# EAGLE design ESP32 UWB Pro with Display v1.2 (EAGLE 6.1)
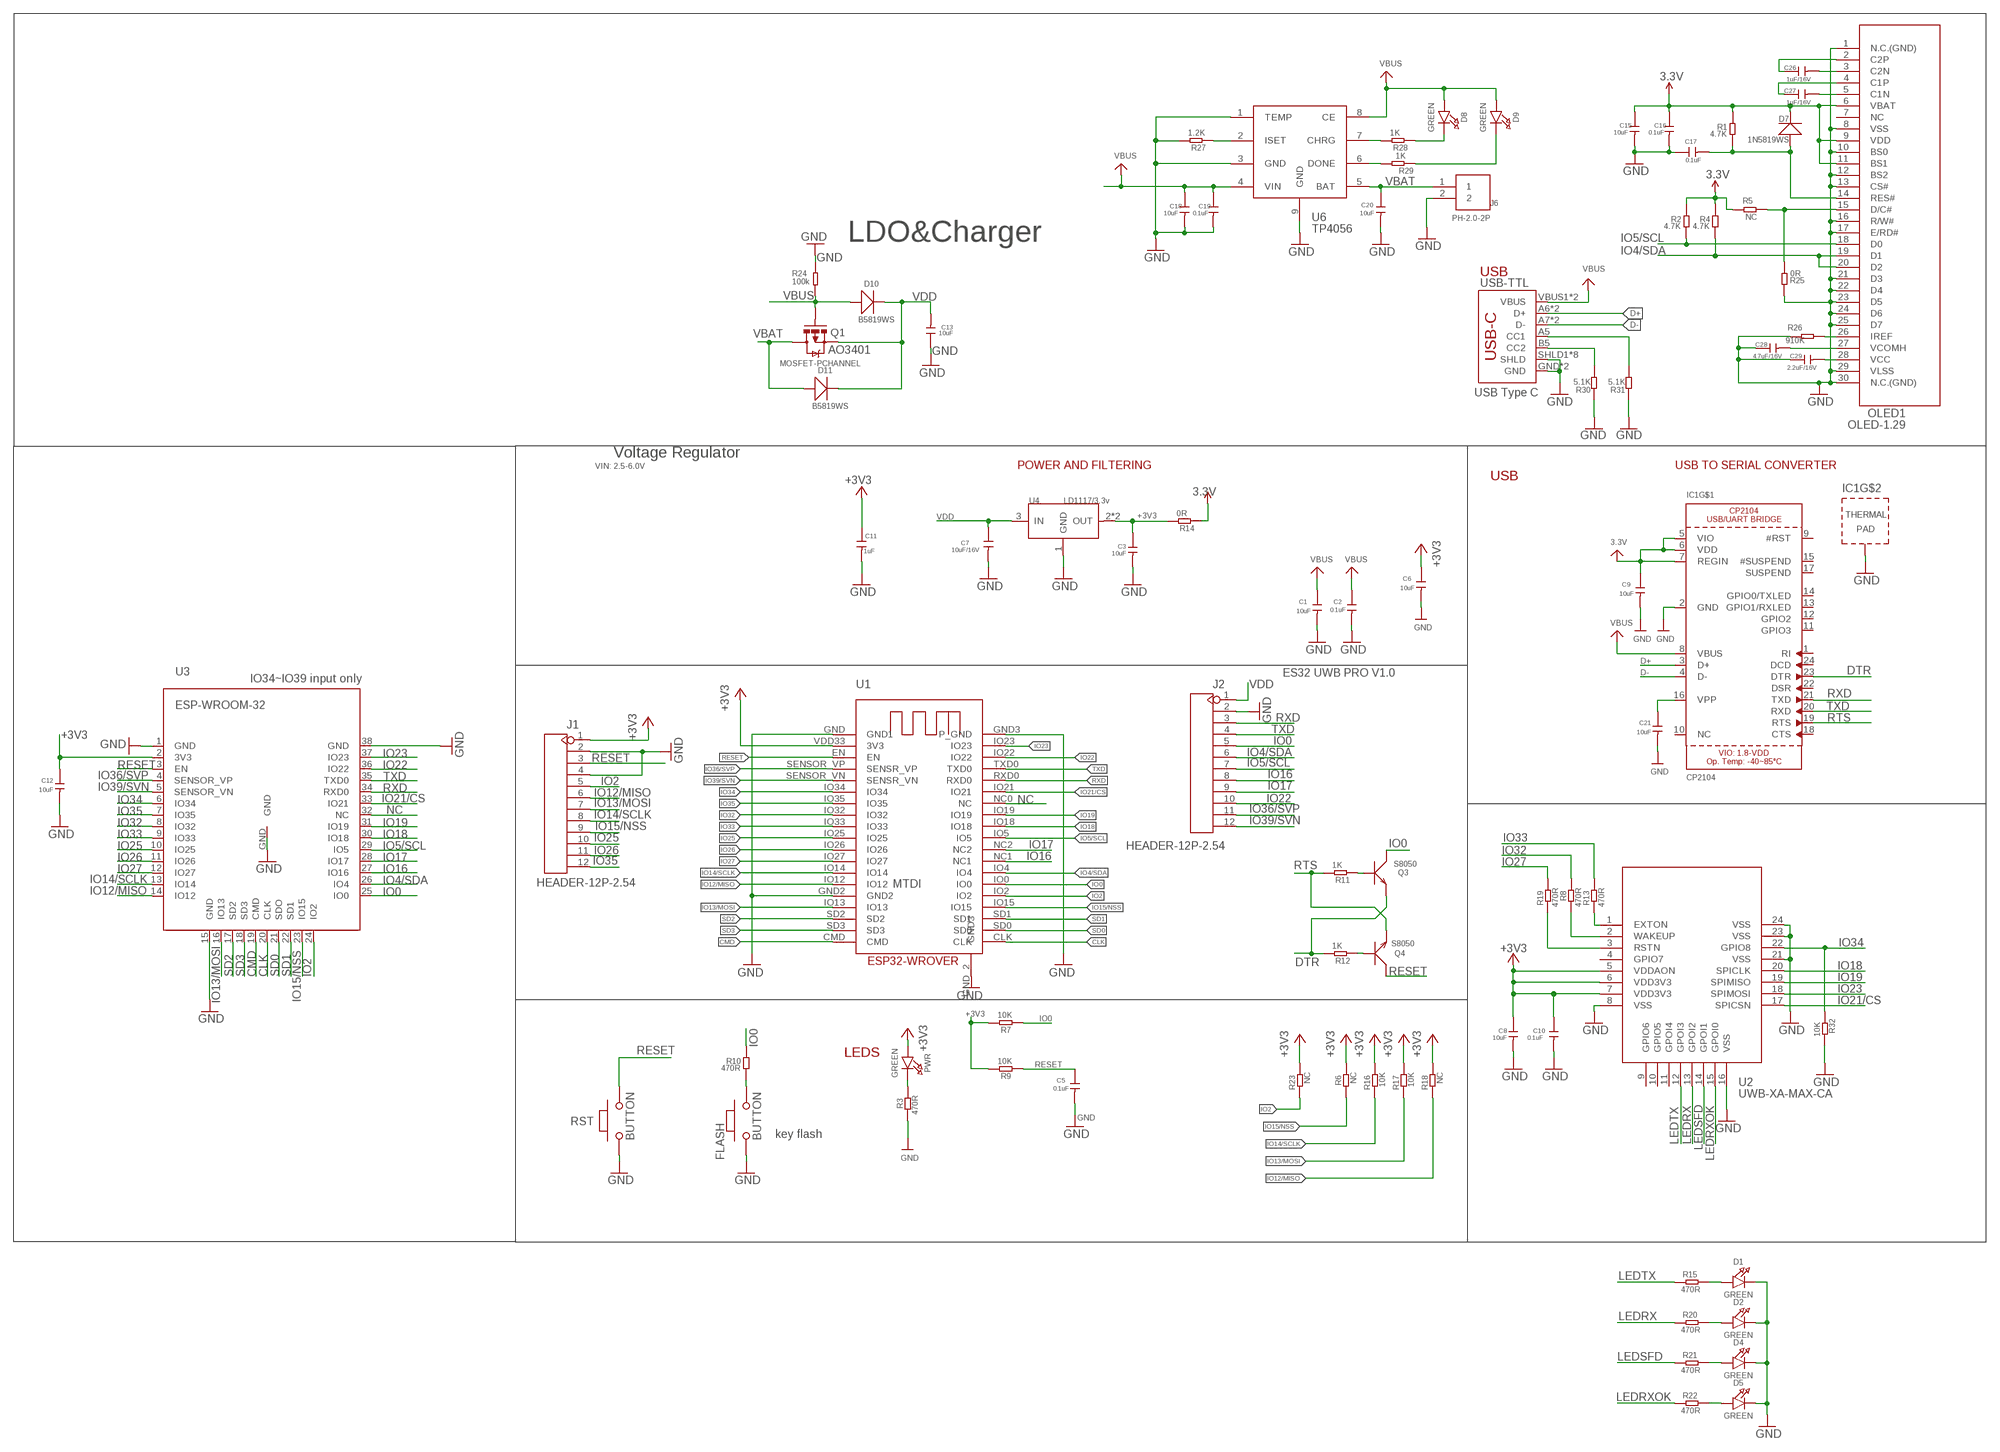
[diagram p0: schematic, sheet 1]

## Parts
C1  10uF  C-0603  [0603]
C2  0.1uF  C-0603  [0603]
C3  10uF  C-0603  [0603]
C5  0.1uF  C-0603  [0603]
C6  10uF  C-0603  [0603]
C7  10uF/16V  C-0603  [0603]
C8  10uF  C-0603  [0603]
C9  10uF  C-0603  [0603]
C10  0.1uF  C-0603  [0603]
C11  1uF  C-0603  [0603]
C12  10uF  C-0603  [0603]
C13  10uF  C-0603  [0603]
C15  10uF  C-0603  [0603]
C16  0.1uF  C-0603  [0603]
C17  0.1uF  C-0603  [0603]
C18  10uF  C-0603  [0603]
C19  0.1uF  C-0603  [0603]
C20  10uF  C-0603  [0603]
C21  10uF  C-0603  [0603]
C26  1uF/16V  C-0603  [0603]
C27  1uF/16V  C-0603  [0603]
C28  4.7uF/16V  C-0603  [0603]
C29  2.2uF/16V  C-0603  [0603]
D1  GREEN  LED0805_NOOUTLINE  [CHIPLED_0805_NOOUTLINE]
D2  GREEN  LED0805_NOOUTLINE  [CHIPLED_0805_NOOUTLINE]
D4  GREEN  LED0805_NOOUTLINE  [CHIPLED_0805_NOOUTLINE]
D5  GREEN  LED0805_NOOUTLINE  [CHIPLED_0805_NOOUTLINE]
D7  1N5819WS  D'0805'  [SOD323]
D8  GREEN  LED0805_NOOUTLINE  [CHIPLED_0805_NOOUTLINE]
D9  GREEN  LED0805_NOOUTLINE  [CHIPLED_0805_NOOUTLINE]
D10  B5819WS  D'0805'  [SOD323]
D11  B5819WS  D'0805'  [SOD323]
FLASH  BUTTON  PB157  [157SW]
IC1  CP2104  [QFN24_4MM_SMSC]
J1  HEADER-12P-2.54  [12P-2.54]
J2  HEADER-12P-2.54  [12P-2.54]
J6  PH-2.0-2P  [PH-2.0-2P]
OLED1  OLED-1.29  [OLED-1.29]
PWR  GREEN  LED0805_NOOUTLINE  [CHIPLED_0805_NOOUTLINE]
Q1  MOSFET-PCHANNEL  [SOT23-3]
Q3  S8050  TRANSISTOR-NPN-SOT23  [SOT23]
Q4  S8050  TRANSISTOR-NPN-SOT23  [SOT23]
R1  4.7K  R-0603  [R0603]
R2  4.7K  R-0603  [R0603]
R3  470R  R-0603  [R0603]
R4  4.7K  R-0603  [R0603]
R5  NC  R-0603  [R0603]
R6  NC  R-0603  [R0603]
R7  10K  R-0603  [R0603]
R8  470R  R-0603  [R0603]
R9  10K  R-0603  [R0603]
R10  470R  R-0603  [R0603]
R11  1K  R-0603  [R0603]
R12  1K  R-0603  [R0603]
R13  470R  R-0603  [R0603]
R14  0R  R-0603  [R0603]
R15  470R  R-0603  [R0603]
R16  10K  R-0603  [R0603]
R17  10K  R-0603  [R0603]
R18  NC  R-0603  [R0603]
R19  470R  R-0603  [R0603]
R20  470R  R-0603  [R0603]
R21  470R  R-0603  [R0603]
R22  470R  R-0603  [R0603]
R23  NC  R-0603  [R0603]
R24  100k  R-0603  [R0603]
R25  0R  R-0603  [R0603]
R26  910K  R-0603  [R0603]
R27  1.2K  R-0603  [R0603]
R28  1K  R-0603  [R0603]
R29  1K  R-0603  [R0603]
R30  5.1K  DISCRETE_R-0603  [DISCRETE_R0603]
R31  5.1K  DISCRETE_R-0603  [DISCRETE_R0603]
R32  10K  R-0603  [R0603]
RST  BUTTON  PB157  [157SW]
U1  ESP32-WROVER  [ESP32-WROVER]
U2  UWB-XA-MAX-CA  [UWB-X1-MAK-CA]
U3  ESP-WROOM-32  [ESP-WROOM-32]
U4  LD1117/3.3v  LD1117'SOT89'  [SOT89]
U6  TP4056  [SOP8-1.27P]
USB-TTL  USB_C5  [USB-C-16P-5]

## Nets
3.3V: C15.1 C16.1 D7.- OLED1.6(VBAT) OLED1.9(VDD) OLED1.11(BS1) R1.2 R2.2 R4.2 R5.2 R14.1
+3V3: C3.1 C6.1 C8.1 C9.1 C10.1 C11.1 C12.1 IC1.5(VIO) IC1.6(VDD) IC1.7(REGIN) J1.1 PWR.A R6.2 R7.2 R9.2 R14.2 R16.2 R17.2 R18.2 R23.2 U1.VDD33(3V3) U2.5(VDDAON) U2.6(VDD3V3) U2.7(VDD3V3) U3.2(3V3) U4.2(OUT) U4.4(OUT) ; supply symbol labelled 3.3V
CLK: U1.CLK U3.20(CLK)
CMD: U1.CMD U3.19(CMD)
D+: IC1.3(D+) USB-TTL.A6(D+) USB-TTL.B6(D+)
D-: IC1.4(D-) USB-TTL.A7(D-) USB-TTL.B7(D-)
DTR: IC1.23(DTR) Q3.2(E) R12.2
GND: C1.2 C2.2 C3.2 C5.2 C6.2 C7.2 C8.2 C9.2 C10.2 C11.2 C12.2 C13.1 C15.2 C16.2 C17.1 C18.2 C19.2 C20.2 C21.2 C28.1 C29.1 D1.C D2.C D4.C D5.C FLASH.1 IC1.2(GND) IC1.THERM(TP) J1.2 J1.4 J2.2 J6.2 OLED1.1(N.C.(GND)) OLED1.8(VSS) OLED1.10(BS0) OLED1.12(BS2) OLED1.13(CS#) OLED1.16(R/W#) OLED1.17(E/RD#) OLED1.21(D3) OLED1.22(D4) OLED1.23(D5) OLED1.24(D6) OLED1.25(D7) OLED1.29(VLSS) OLED1.30(N.C.(GND)) R3.1 R24.2 R25.2 R26.2 R27.2 R30.1 R31.1 R32.2 RST.1 U1.GND2 U1.GND3(P_GND) U1.GND(GND1) U1.GND_2(GND3) U2.8(VSS) U2.16(VSS) U2.21(VSS) U2.23(VSS) U2.24(VSS) U3.1(GND) U3.15(GND) U3.38(GND) U3.GND U4.1(GND) U6.1(TEMP) U6.3(GND) U6.9(GND) USB-TTL.GND USB-TTL.GND2(GND) USB-TTL.SHLD1(SHLD) USB-TTL.SHLD2(SHLD) USB-TTL.SHLD3(SHLD) USB-TTL.SHLD4(SHLD) USB-TTL.SHLD5(SHLD) USB-TTL.SHLD6(SHLD) USB-TTL.SHLD7(SHLD) USB-TTL.SHLD8(SHLD)
IO0: J2.5 Q3.3(C) R7.1 R10.2 U1.IO0 U3.25(IO0)
IO2: J1.5 R23.1 U1.IO2 U3.24(IO2)
IO4/SDA: J2.6 OLED1.19(D1) OLED1.20(D2) R4.1 U1.IO4 U3.26(IO4)
IO5/SCL: J2.7 OLED1.18(D0) R2.1 U1.IO5 U3.29(IO5)
IO12/MISO: J1.6 R18.1 U1.IO12 U3.14(IO12)
IO13/MOSI: J1.7 R17.1 U1.IO13 U3.16(IO13)
IO14/SCLK: J1.8 R16.1 U1.IO14 U3.13(IO14)
IO15/NSS: J1.9 R6.1 U1.IO15 U3.23(IO15)
IO16: J2.8 U1.NC1 U3.27(IO16)
IO17: J2.9 U1.NC2 U3.28(IO17)
IO18: U1.IO18 U2.20(SPICLK) U3.30(IO18)
IO19: U1.IO19 U2.19(SPIMISO) U3.31(IO19)
IO21/CS: U1.IO21 U2.17(SPICSN) U3.33(IO21)
IO22: J2.10 U1.IO22 U3.36(IO22)
IO23: U1.IO23 U2.18(SPIMOSI) U3.37(IO23)
IO25: J1.10 U1.IO25 U3.10(IO25)
IO26: J1.11 U1.IO26 U3.11(IO26)
IO27: R19.2 U1.IO27 U3.12(IO27)
IO32: R8.2 U1.IO32 U3.8(IO32)
IO33: R13.2 U1.IO33 U3.9(IO33)
IO34: R32.1 U1.IO34 U2.22(GPIO8) U3.6(IO34)
IO35: J1.12 U1.IO35 U3.7(IO35)
IO36/SVP: J2.11 U1.SENSOR_VP(SENSR_VP) U3.4(SENSOR_VP)
IO39/SVN: J2.12 U1.SENSOR_VN(SENSR_VN) U3.5(SENSOR_VN)
LEDRX: R20.1 U2.13(GPOI2)
LEDRXOK: R22.1 U2.15(GPOI0)
LEDSFD: R21.1 U2.14(GPOI1)
LEDTX: R15.1 U2.12(GPOI3)
N$1: D1.A R15.2
N$2: C21.1 IC1.16(VPP)
N$3: C17.2 D7.+ OLED1.14(RES#) R1.1
N$4: OLED1.15(D/C#) R5.1 R25.1
N$5: PWR.C R3.2
N$6: C28.2 OLED1.27(VCOMH)
N$7: C26.2 OLED1.3(C2N)
N$8: C29.2 OLED1.28(VCC)
N$9: OLED1.26(IREF) R26.1
N$10: R13.1 U2.1(EXTON)
N$11: R8.1 U2.2(WAKEUP)
N$12: R19.1 U2.3(RSTN)
N$13: Q4.1(B) R12.1
N$14: Q3.1(B) R11.1
N$15: FLASH.2 R10.1
N$16: D2.A R20.2
N$17: D4.A R21.2
N$18: D5.A R22.2
N$19: C26.1 OLED1.2(C2P)
N$21: C27.1 OLED1.4(C1P)
N$22: C27.2 OLED1.5(C1N)
N$23: R27.1 U6.2(ISET)
N$25: R31.2 USB-TTL.A5(CC1)
N$26: R30.2 USB-TTL.B5(CC2)
N$29: R28.2 U6.7(CHRG)
N$30: R29.2 U6.6(DONE)
N$31: D8.C R28.1
N$32: D9.C R29.1
NC: U1.NC0(NC) U3.32(NC)
RESET: C5.1 J1.3 Q4.3(C) R9.1 RST.2 U1.EN U3.3(EN)
RTS: IC1.19(RTS) Q4.2(E) R11.2
RXD: IC1.21(TXD) J2.3 U1.RXD0 U3.34(RXD0)
SD0: U1.SD0 U3.21(SDO)
SD1: U1.SD1 U3.22(SD1)
SD2: U1.SD2 U3.17(SD2)
SD3: U1.SD3 U3.18(SD3)
TXD: IC1.20(RXD) J2.4 U1.TXD0 U3.35(TXD0)
VBAT: C20.1 D11.+ J6.1 Q1.3(D) U6.5(BAT)
VBUS: C1.1 C2.1 C18.1 C19.1 D8.A D9.A D10.+ IC1.8(VBUS) Q1.1(G) R24.1 U6.4(VIN) U6.8(CE) USB-TTL.VBUS1(VBUS) USB-TTL.VBUS2(VBUS)
VDD: C7.1 C13.2 D10.- D11.- J2.1 Q1.2(S) U4.3(IN)
Unconnected: IC1.1(RI) IC1.9(#RST) IC1.10(NC) IC1.11(GPIO3) IC1.12(GPIO2) IC1.13(GPIO1/RXLED) IC1.14(GPIO0/TXLED) IC1.15(#SUSPEND) IC1.17(SUSPEND) IC1.18(CTS) IC1.22(DSR) IC1.24(DCD) OLED1.7(NC) U2.4(GPIO7) U2.9(GPIO6) U2.10(GPIO5) U2.11(GPOI4)

## Notes on the sheet
- LDO&Charger
- USB
- AO3401
- USB Type C
- Voltage Regulator
- VIN: 2.5-6.0V | POWER AND FILTERING | USB TO SERIAL CONVERTER
- USB
- ES32 UWB PRO V1.0
- IO34~IO39 input only
- MTDI
- LEDS
- key flash

## Library data of the parts
C1-C3 C5-C13 C15-C21 C26-C29 = Discrete:C*: Ceramic Capacitors
D1 D2 D4 D5 D8 D9 PWR = microbuilder:LED: LED 0603 - 0603 Surface Mount Package 2mA: Green LED - Low Power (3.9mcd, 2ma, 1.7Vf) - Digikey: 475-2709-2-ND Orange LED - Low Power (9.8mcd, 2ma, 1.8Vf) - Digikey: 475-1194-2-ND Red LED - Low Power (5mcd, 2ma, 1.8Vf) - Digikey: 475-1195-2-ND Yellow LED - Low Power (7mcd, 2ma, 1.8Vf) - Digikey: 475-1196-2-ND 5mA: Blue LED - Low Power (17mcd, 5ma, 2.9Vf) - Digikey: LNJ937W8CRACT-ND 0805 - 0805 Surface Mount Package 2mA: Red LED (8.8mcd, 2mA, 1.8Vf, Clear) - Low Power [Digikey: 475-2510-1-ND] Green LED (5mcd, 2mA, 1.8Vf, Clear) - Low Power [Digikey: 475-2730-1-ND] Yellow LED (11.3mcd, 2mA, 1.8Vf, Clear) - Low Power [Digikey: 475-2555-1-ND] 20mA: Red LED (104mcd, 20mA, Diffused) - LS R976 [Digikey: 475-1278-6-ND] Red LED (12mcd, 20mA, 2.0Vf, Clear) - APT2012EC [Digikey: 754-1128-1-ND] Green LED (15mcd, 20mA, 2.2Vf, Clear) - APT2012GC [Digikey: 754-1131-1-ND] Orange LED (160mcd, 20mA, 2.1Vf, Clear) - APT2012SECK [Digikey: 754-1130-1-ND] 1206 - 1206 Surface Mount Package Green LED (26mcd, 20mA, Diffused) - LG N971 [Digikey: 475-1407-6-ND] Red LED (15mcd, 20mA, Diffused) - LH N974 [Digikey: 475-1416-6-ND] Cree - Cree High-Power Surface Mount LEDs XPEBWT-L1-0000-00D50 - White 111lm 350mA 2.9Vf 6200K 110° XTEAWT-00-0000-00000LEE3 - White 114lm 350mA 2.85Vf 5000K 115° Everlight - Everlight 45-21 Series Surface Mount LEDs 45-21/QK2C-B2832AC2CB2/2T - Warm White 2000mcd 20mA 3.25Vf 3050K 120° 45-21/LK2C-B38452C4CB2/2T - Nuetral White 2000mcd 20mA 3.25Vf 4150K 120° 45-21/LK2C-B50634C6CB2/2T - Cold White 2200mcd 20mA 3.25Vf 5650K 120° PLCC2 Reverse Mount LS T77K-J1L2-1-0-2-R18-Z - Red 11.25mcd 2mA 1.8Vf 630nm 120° LO T77K-L1M2-24-Z - Orange 19.6mcd 2mA 1.8Vf 606nm 120° LY T77K-K2M1-26-Z - Yellow 15.7mcd 2mA 1.8Vf 587nm 120°
D7 D10 D11 = Discrete:D*
FLASH RST = MySMD:PB157
IC1 = microbuilder:CP2104: CP2104 - USB to UART Bridge VDD Output: 3.45V
J1 J2 = Connector:HEADER-12P
J6 = Connector:PH-2.0-2P
OLED1 = sale:OLED-1.29
Q1 = User-Submitted:MOSFET-PCHANNEL: Generic PMOSFET IRLML2244 - TRANS-11153 (SOT-23 -20V -4.3A) (1.Gate 2.Source 3.Drain) FQP27P06 - COM-10349 <http://www.sparkfun.com/products/10349> (TO-220 -60V -27A) (1.Gate 2.Source 3.Drain); PROD_ID: TRANS-08285
Q3 Q4 = Discrete:TRANSISTOR-NPN*: NPN audion
R1-R29 R32 = Discrete:R*
R30 R31 = A9G:DISCRETE_R*
U1 = ESP32-Wrover:ESP32-WROVER
U2 = sale:UWB-XA-MAX-CA
U3 = esp32:ESP-WROOM-32
U4 = IC:LD1117: Low Drop Fixed And Adjustable Positive Voltage Regulators http://www.datasheetcatalog.org/datasheet/SGSThomsonMicroelectronics/mXuqtqv.pdf
U6 = self:TP4056
USB-TTL = USBC:USB_C: USB Type C 16Pin Connector Super Speed pins not available on the 16-pin purely SMD connector so this part is best for USB 2.0 implementations. D1 and D2 are tied together enabling D+/- no matter which way the cable is plugged into the connector. The two channel configuration pins (CC1/2) are exposed. These are normally connected to ground via 5.1k resistors but can be reconfigured for high current/high power applications.

## Net classes
0 default: width 0.203 mm, drill 0.305 mm, clearance 0.152 mm

## Board
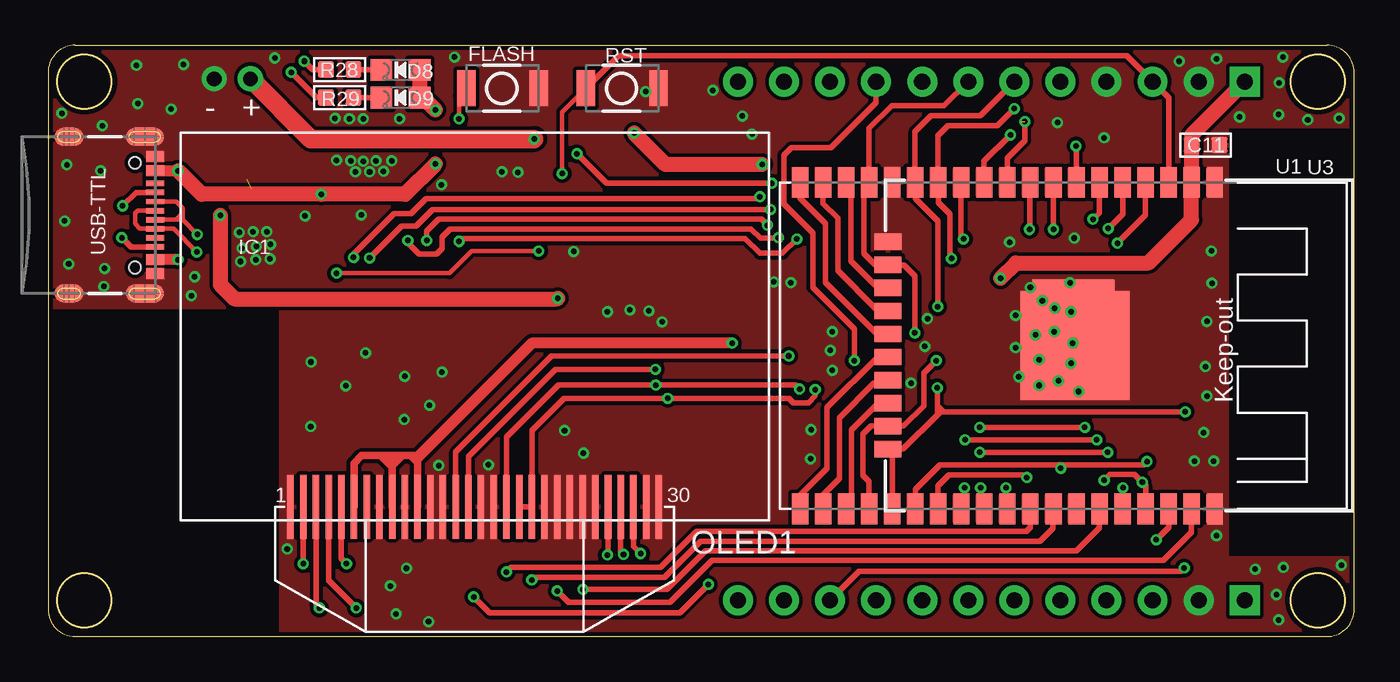
[diagram p1: board, top side]
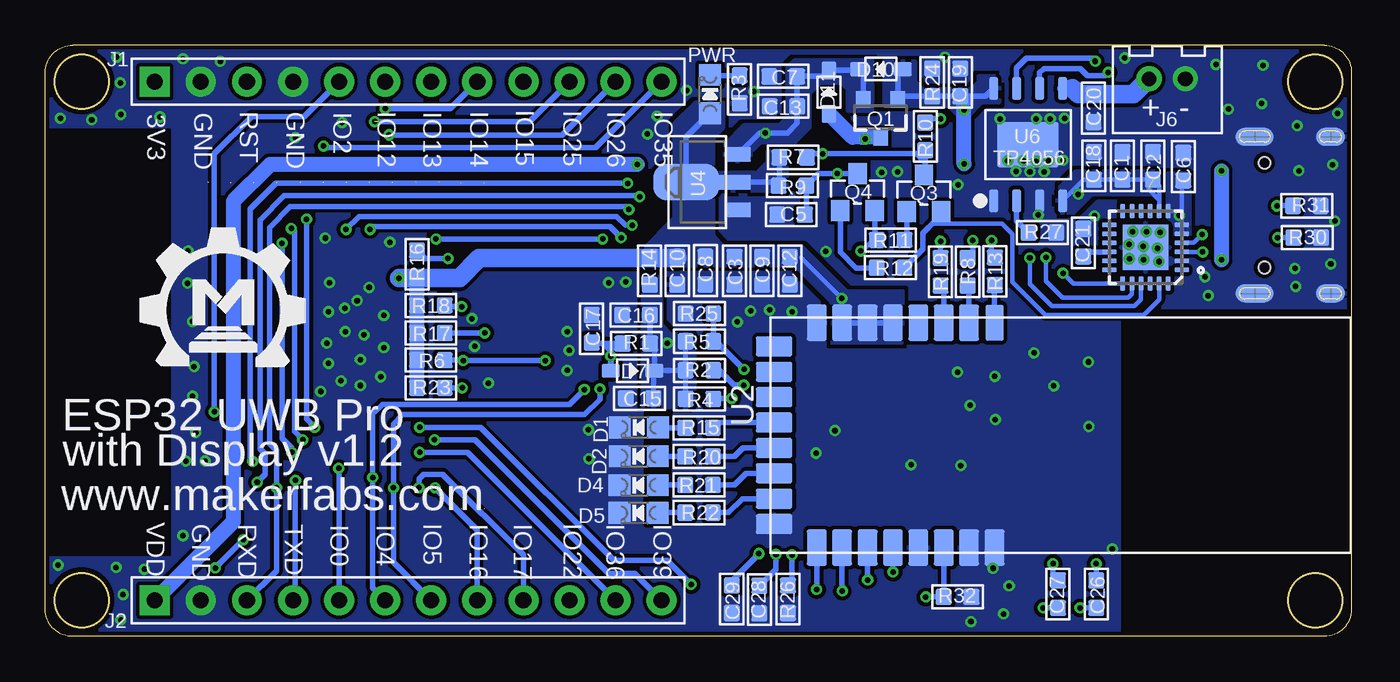
[diagram p2: board, bottom side, seen from below]

Size 72 x 32.6 mm. Coordinates in mm from the lower left corner, seen from the top.
Outline: 70.5,0 arc90 72,1.5 72,31.1 arc90 70.5,32.6 1.5,32.6 arc90 0,31.1 0,1.5 arc90 1.5,0 arc0 1.5,0 70.5,0
Outline: circle at 2,2 radius 1.5
Outline: circle at 2,30.6 radius 1.5
Outline: circle at 70,30.6 radius 1.5
Outline: circle at 70,2 radius 1.5
Copper layers (1*16): Top 0.035mm / dielectric 1.5mm / Bottom 0.035mm
Design rules: minimum track width 10mil, minimum drill 10mil, track to track 8mil, track to pad 8mil, pad to pad 8mil, via to via 8mil, smd to smd 0mil, copper to edge 10mil, drill to drill 8mil, minimum pad ring 10mil, minimum via ring 6mil, stop-mask expansion 4mil, vias tented up to drill 100mil, thermal gap 0mil
tRestrict: area 65.1,4.4 to 72,28; area 0,-0.1 to 12.7,18
bRestrict: area 65.1,4.4 to 71.9,28; area 0,0 to 12.7,18

### Footprints (pad centres in the part's own frame; a part is rotated, then mirrored left to right if it is on the bottom)
0603 = smd 0.889 x 0.889: 1 -0.762,0; 2 0.762,0
CHIPLED_0805_NOOUTLINE = smd 1.2 x 1.2: A 0,-1.05; C 0,1.05
SOD323 = smd 1 x 0.8: + -1.2,0; - 1.2,0
157SW = smd 1.016 x 1.981: 1 0,0; 2 4,0
QFN24_4MM_SMSC = smd 0.8 x 0.28: 1 -2,1.25; 2 -2,0.75; 3 -2,0.25; 4 -2,-0.25; 5 -2,-0.75; 6 -2,-1.25; 13 2,-1.25; 14 2,-0.75; 15 2,-0.25; 16 2,0.25; 17 2,0.75; 18 2,1.25 | smd 0.28 x 0.8: 7 -1.25,-2; 8 -0.75,-2; 9 -0.25,-2; 10 0.25,-2; 11 0.75,-2; 12 1.25,-2; 19 1.25,2; 20 0.75,2; 21 0.25,2; 22 -0.25,2; 23 -0.75,2; 24 -1.25,2 | smd 2.5 x 2.5: THERM 0,0
12P-2.54 = drill 0.889 pad 1.651 square: 1 0,13.97 | drill 0.889 pad 1.651: 2 0,11.43; 3 0,8.89; 4 0,6.35; 5 0,3.81; 6 0,1.27; 7 0,-1.27; 8 0,-3.81; 9 0,-6.35; 10 0,-8.89; 11 0,-11.43; 12 0,-13.97
PH-2.0-2P = drill 0.8 pad 1.4: 1 -1,0; 2 1,0
OLED-1.29 = smd 0.4 x 3.5: 1 -10.15,-9.94; 2 -9.45,-9.94; 3 -8.75,-9.94; 4 -8.05,-9.94; 5 -7.35,-9.94; 6 -6.65,-9.94; 7 -5.95,-9.94; 8 -5.25,-9.94; 9 -4.55,-9.94; 10 -3.85,-9.94; 11 -3.15,-9.94; 12 -2.45,-9.94; 13 -1.75,-9.94; 14 -1.05,-9.94; 15 -0.35,-9.94; 16 0.35,-9.94; 17 1.05,-9.94; 18 1.75,-9.94; 19 2.45,-9.94; 20 3.15,-9.94; 21 3.85,-9.94; 22 4.55,-9.94; 23 5.25,-9.94; 24 5.95,-9.94; 25 6.65,-9.94; 26 7.35,-9.94; 27 8.05,-9.94; 28 8.75,-9.94; 29 9.45,-9.94; 30 10.15,-9.94
SOT23-3 = smd 0.8 x 0.9: 1 -0.95,-1; 2 0.95,-1; 3 0,1.1
SOT23 = smd 1.016 x 1.143: 1 -0.95,-1.016; 2 0.95,-1.016; 3 0,1.016
R0603 = smd 0.889 x 0.889: 1 -0.762,0; 2 0.762,0
DISCRETE_R0603 = smd 0.889 x 0.889: 1 -0.762,0; 2 0.762,0
ESP32-WROVER = smd 1.7 x 0.9: CLK 18,1.27; CMD 0,1.27; EN 0,21.59; GND 0,24.13; GND3 18,24.13; GND_2 0,6.35; IO0 18,7.62; IO2 18,6.35; IO4 18,8.89; IO5 18,12.7; IO12 0,7.62; IO13 0,5.08; IO14 0,8.89; IO15 18,5.08; IO18 18,13.97; IO19 18,15.24; IO21 18,17.78; IO22 18,21.59; IO23 18,22.86; IO25 0,12.7; IO26 0,11.43; IO27 0,10.16; IO32 0,15.24; IO33 0,13.97; IO34 0,17.78; IO35 0,16.51; NC0 18,16.51; NC1 18,10.16; NC2 18,11.43; RXD0 18,19.05; SD0 18,2.54; SD1 18,3.81; SD2 0,3.81; SD3 0,2.54; SENSOR_VN 0,19.05; SENSOR_VP 0,20.32; TXD0 18,20.32; VDD33 0,22.86 | smd 4.5 x 4.5: GND2 7.62,16.34
UWB-X1-MAK-CA = smd 2 x 1: 1 -6.2,-3.65 | smd 2 x 1.1: 2 -6.2,-5.05; 3 -6.2,-6.45; 4 -6.2,-7.85; 5 -6.2,-9.25; 6 -6.2,-10.65; 7 -6.2,-12.05; 8 -6.2,-13.45; 17 6.2,-13.45; 18 6.2,-12.05; 19 6.2,-10.65; 20 6.2,-9.25; 21 6.2,-7.85; 22 6.2,-6.45; 23 6.2,-5.05; 24 6.2,-3.65 | smd 1.1 x 2: 9 -4.9,-15.8; 10 -3.5,-15.8; 11 -2.1,-15.8; 12 -0.7,-15.8; 13 0.7,-15.8; 14 2.1,-15.8; 15 3.5,-15.8; 16 4.9,-15.8
ESP-WROOM-32 = smd 0.9 x 1.5: 1 7.7,9; 2 6.43,9; 3 5.16,9; 4 3.89,9; 5 2.62,9; 6 1.35,9; 7 0.08,9; 8 -1.19,9; 9 -2.46,9; 10 -3.73,9; 11 -5,9; 12 -6.27,9; 13 -7.54,9; 14 -8.81,9; 25 -8.81,-9; 26 -7.54,-9; 27 -6.27,-9; 28 -5,-9; 29 -3.73,-9; 30 -2.46,-9; 31 -1.19,-9; 32 0.08,-9; 33 1.35,-9; 34 2.62,-9; 35 3.89,-9; 36 5.16,-9; 37 6.43,-9; 38 7.7,-9 | smd 1.5 x 0.9: 15 -10.3,5.715; 16 -10.3,4.445; 17 -10.3,3.175; 18 -10.3,1.905; 19 -10.3,0.635; 20 -10.3,-0.635; 21 -10.3,-1.905; 22 -10.3,-3.175; 23 -10.3,-4.445; 24 -10.3,-5.715 | smd 6 x 6: GND 0,0
SOT89 = smd 0.8 x 1.4: 1 -1.524,-1.905; 3 1.524,-1.905 | smd 0.8 x 1.9: 2 0,-1.651 | smd 2.032 x 3.65: 4 0,0.94
SOP8-1.27P = smd 1.27 x 0.51: 1 -3.1,1.905; 2 -3.1,0.635; 3 -3.1,-0.635; 4 -3.1,-1.905; 5 3.1,-1.905; 6 3.1,-0.635; 7 3.1,0.635; 8 3.1,1.905 | smd 2.5 x 3.4: 9 0,0
USB-C-16P-5 = smd 0.3 x 1: A5 -1.25,-0.34; A6 -0.25,-0.34; A7 0.25,-0.34; A8 1.25,-0.34; B5 1.75,-0.34; B6 0.75,-0.34; B7 -0.75,-0.34; B8 -1.75,-0.34 | smd 0.6 x 1: GND -3.225,-0.34; GND2 3.225,-0.34; VBUS1 -2.45,-0.34; VBUS2 2.45,-0.34 | smd 1 x 2.1: SHLD1 -4.32,-0.915; SHLD2 4.32,-0.915 | smd 1 x 2.1 bottom: SHLD3 -4.32,-0.915; SHLD4 4.32,-0.915 | smd 1 x 1.6: SHLD5 -4.32,-5.095; SHLD8 4.32,-5.095 | smd 1 x 1.6 bottom: SHLD6 -4.32,-5.095; SHLD7 4.32,-5.095 | hole 0.65: -2.89,-1.445; 2.89,-1.445

### Placement (x,y rotation side)
C1  12.62,25.96 90 bottom
C2  10.95,25.96 90 bottom
C3  34.01,20.17 270 bottom
C5  30.89,23.27 180 bottom
C6  9.27,25.91 90 bottom
C7  31.33,30.89 180 bottom
C8  35.62,20.18 270 bottom
C9  32.49,20.17 270 bottom
C10  37.17,20.17 270 bottom
C11  63.8,27.1 0 top
C12  30.96,20.17 270 bottom
C13  31.32,29.24 0 bottom
C15  39.24,13.13 180 bottom
C16  39.45,17.73 180 bottom
C17  41.88,16.97 270 bottom
C18  14.2,25.96 90 bottom
C19  21.56,30.56 90 bottom
C20  14.22,29.13 270 bottom
C21  14.78,21.72 90 bottom
C26  14.07,2.34 270 bottom
C27  16.18,2.34 90 bottom
C28  32.64,2.03 90 bottom
C29  34.16,2.06 90 bottom
D1  39.28,11.54 90 bottom
D2  39.29,9.94 90 bottom
D4  39.3,8.34 90 bottom
D5  39.3,6.81 90 bottom
D7  39.62,14.66 0 bottom
D8  19.43,31.24 90 top
D9  19.43,29.72 90 top
D10  25.93,31.29 180 bottom
D11  28.8,30.02 90 bottom
FLASH  27.05,30.23 180 top
IC1  11.36,21.46 180 bottom
J1  52,30.6 90 bottom
J2  52,2 90 bottom
J6  10.16,30.76 0 bottom
OLED1  23.52,17.09 0 top
PWR  35.36,29.91 0 bottom
Q1  25.96,28.63 180 bottom
Q3  23.57,24.45 0 bottom
Q4  27.23,24.51 0 bottom
R1  39.42,16.15 0 bottom
R2  35.94,14.68 180 bottom
R3  33.73,30.18 90 bottom
R4  35.94,13.11 180 bottom
R5  35.94,16.28 180 bottom
R6  50.75,15.24 180 bottom
R7  30.78,26.42 180 bottom
R8  21.16,20.12 90 bottom
R9  30.82,24.86 180 bottom
R10  23.5,27.58 270 bottom
R11  25.41,21.87 180 bottom
R12  25.41,20.34 0 bottom
R13  19.66,20.14 90 bottom
R14  38.68,20.17 90 bottom
R15  35.97,11.51 180 bottom
R16  51.51,20.52 270 bottom
R17  50.75,16.74 180 bottom
R18  50.75,18.26 180 bottom
R19  22.66,20.12 90 bottom
R20  35.97,9.93 180 bottom
R21  35.97,8.36 180 bottom
R22  35.97,6.83 180 bottom
R23  50.75,13.72 180 bottom
R24  23.11,30.56 90 bottom
R25  35.94,17.81 180 bottom
R26  31.06,2.06 270 bottom
R27  17.04,22.28 0 bottom
R28  16.08,31.27 180 top
R29  16.08,29.72 180 top
R30  2.44,22 180 bottom
R31  2.46,23.75 180 bottom
R32  21.72,2.18 0 bottom
RST  33.66,30.23 180 top
U1  40.19,25.04 270 top
U2  16.03,11.1 270 bottom
U3  56.6,16.05 0 top
U4  35.74,25.05 90 bottom
U6  17.83,27.13 90 bottom
U$1  [MAKERFABS_0.3]  66.31,14.92 0 bottom
USB-TTL  6.25,23.23 270 top

### Tracks (layer width: path | path; a pad name or v marks a point on that pad's centre or on a via)
3.3V  (via drill 0.3)
  Top 0.305: OLED1.11
  Top 0.406: OLED1.6 16.87,9.56 17.3,9.98 18.34,9.98 | 18.34,9.98 19.07,9.98 | 19.07,9.98 19.56,9.98 | 19.99,9.98 20.47,9.98 | OLED1.11 20.37,9.88 20.65,10.16 | OLED1.9 18.97,9.88 19.07,9.98 | 18.34,9.98 18.95,9.37 19.56,9.98 | 19.56,9.98 19.99,9.98 | 19.99,9.98 20.37,9.6
  Top 0.61: v37.72,16.18 26.67,16.18 20.65,10.16 20.47,9.98 20.34,9.86 20.32,9.86
  Bottom 0.305: R4.2 R2.2 | R2.2 R5.2 | C15.1 38.48,14.6 D7.- | D7.- 38.42,15.92 R1.2 38.66,17.17 | 38.66,17.17 38.66,17.7 C16.1 | R2.2 38.4,14.68 D7.- | 38.63,17.2 38.66,17.17
  pour Bottom: 36.27,12.67 39.04,12.67 39.04,19.81 38.1,19.81 38.1,17.2 37.54,16.64 36.27,16.64
+3V3  (via drill 0.3)  (1 unrouted)
  Top 0.813: v9.5,23.22 9.5,19.41 10.29,18.62 28.07,18.62 v28.09,18.64 | v52.5,19.76 53.34,20.6 60.66,20.6 63.03,22.98 U3.2 | U1.VDD33 C11.1 63.04,27.67 J1.1
  Bottom 0.254: IC1.5 IC1.6 9.36,23.32 | 9.36,23.32 9.36,25.06 C6.1 | IC1.7 9.5,23.46 9.36,23.32 | 25.93,17.35 25.88,17.3 | U2.7 28.08,18.63 v28.09,18.64 30.35,20.9
  Bottom 0.305: U2.5 25.88,17.3 U2.6 U2.7 | R7.2 31.54,24.9 R9.2 31.77,25.05 U4.2 U4.4 36.68,27.55 PWR.A
  Bottom 0.813: R23.2 R6.2 R17.2 R18.2 R16.2
  Bottom 1.016: v52.5,19.76 R16.2 49.17,19.76 48.08,20.86 37.17,20.86 C10.1
  pour Bottom: 8.94,22.07 8.94,25.53 10.08,25.53 10.13,25.53 10.13,23.16 9.7,22.73 9.7,22.1 9.7,22.07
  pour Bottom: 24.77,16.21 24.77,19 24.74,19.02 27.84,19.02 30.33,21.51 34.65,21.51 35.2,22.07 35.2,24.13 34.75,24.59 31.14,24.59 31.14,26.75 32.16,26.75 32.16,26.16 32.77,25.55 34.77,25.55 35.2,25.98 35.2,27.51 34.65,28.07 34.65,29.44 36.14,29.44 37.31,28.27 37.31,23.06 39.17,21.21 39.17,20.47 30.68,20.47 28.65,18.44 28.65,16.51 28.65,16.21
CLK
  Top 0.305: U1.CLK 41.46,7.78 42.95,9.27 42.95,12.62 45.72,15.39 46.28,15.39 U3.20
CMD
  Top 0.305: U1.CMD 41.46,24.18 42.85,22.78 42.85,19.53 45.7,16.69 U3.19
D+  (via drill 0.3)
  Top 0.254: USB-TTL.A6 4.94,23.48 4.8,23.34 4.8,22.76 5.05,22.5 5.89,22.5 USB-TTL.B6 6.93,22.48 v8.2,21.21
  Bottom 0.254: v8.2,21.21 v8.21,21.21 IC1.3
D-  (via drill 0.3)
  Top 0.254: USB-TTL.A7 7.27,22.98 7.26,22.99 7.42,22.99 | USB-TTL.B7 7.05,23.98 7.42,23.62 7.42,23.34 | 7.42,22.99 v8.23,22.17 | 7.42,23.34 7.42,22.99 | 7.42,23.34 7.06,22.99
  Bottom 0.254: IC1.4 8.69,21.71 v8.23,22.17
DTR
  Bottom 0.254: IC1.23 10.61,18.58 11.46,17.73 16.87,17.73 18.69,19.56 18.69,22.2 19.28,22.78 23.09,22.78 23.32,22.56
  Bottom 0.305: Q3.2 22.62,23.25 23.32,22.56 23.62,22.25 23.62,21.37 R12.2
GND  (via drill 0.3)
  other vias: 21.03,12.75 3.12,20.29 21.72,14.58 10.54,22.28 11.3,22.33 12.06,22.33 12.27,21.62 12.24,20.83 11.48,21.51 11.46,20.78 10.69,21.41 2.9,25.68 4.88,31.5 4.95,29.39 3,28.17 7.47,31.55 12.5,31.9 0.76,28.85 1.04,26.01 0.91,22.91 1.14,20.55 3.07,19.3 7.9,18.8 14.17,23.19 16.69,26.24 17.37,26.21 18.08,26.24 18.95,26.24 17.73,25.63 18.49,25.65 16.94,25.63 15.9,26.26 15.82,28.58 16.61,28.55 17.37,28.55 19.38,28.55 22.4,31.95 10.62,20.68 8.08,19.84 6.78,29.08 16.41,13.82 19.66,14.35 19.63,11.96 14.48,11.58 14.5,15.14 17.5,15.65 28.47,11.35 29.51,10.11 18.87,2.79 13.18,4.83 19.18,1.24 20.98,0.81 19.76,3.76 24.28,9.47 21.54,9.42 43.23,14.68 40.94,19.51 43.23,16.81 48.34,16 47.57,13.97 54.81,18.52 54.43,16.64 54.64,15.27 55.7,14.1 55.5,18.11 56.34,19.51 56.39,17.91 56.49,16.18 55.47,16.81 56.39,15.06 56.82,13.51 53.52,14.33 53.34,15.93 53.34,17.7 54.15,19.25 54.64,13.84 64.14,21.26 64.16,19.48 63.88,17.37 63.8,14.88 63.88,13.26 63.7,11.25 63.2,9.68 64.26,9.68 64.41,5.56 66.55,3.71 68.1,3.81 71.3,3.94 67.84,0.91 67.72,2.31 42.06,11.4 42.04,9.8 48.49,17.53 53.01,21.74 56.57,21.97 55.65,28.35 58.22,27.51 68.07,31.95 67.87,30.53 67.84,28.78 71.17,28.58 69.44,28.5 65.68,28.65 62.36,31.72 64.41,31.85 32.94,30.05 38.81,27.71 38.28,28.7 36.65,30.12 21.69,24.92 17.27,23.24 28.98,21.23 30.84,17.91 33.12,17.96 33.86,17.35 32.08,18.01 43.13,15.77 25.02,25.63 25.91,25.6 40.01,19.56
  pour Top (rank 6): -8.51,37.36 75.44,37.36 75.44,-3.17 -8.52,-3.17 -8.52,37.36
  pour Bottom (rank 6): -2.29,36.12 76.2,35.56 76.2,-2.54 -2.29,-1.98
IO0  (via drill 0.3)  (1 unrouted)
  Top 0.305: U3.25 47.8,7.06 47.8,8.1 49.17,9.47 55.83,9.47 | 55.83,9.47 60.4,9.47 v60.58,9.65 | v39.9,24.99 30.79,24.99 v29.16,26.62 | v55.83,9.27 55.83,9.47
  Bottom 0.305: R7.1 29.82,26.62 v29.16,26.62 23.99,26.62 23.53,26.16 23.5,26.16 | Q3.3 23.5,25.53 23.5,26.16 | 23.5,26.16 R10.2 | v39.9,24.99 59.28,24.99 60.71,23.57 60.71,9.78 v60.58,9.65 | J2.5 55.81,9.25 v55.83,9.27
IO2  (via drill 0.3)
  Top 0.305: U1.IO2 46.54,10.1 U3.24 47.14,10.33 49.02,12.22 | 49.02,12.22 49.02,12.73 | 49.02,12.73 v49.02,13.72 | v62.69,12.4 49.35,12.4 | 49.35,12.4 49.2,12.4 49.02,12.22 | 49.35,12.4 49.02,12.73
  Bottom 0.305: v62.69,12.4 62.69,26.62 60.63,28.68 57.73,28.68 J1.5 | v49.02,13.72 R23.1
IO4/SDA  (via drill 0.3)  (1 unrouted)
  Top 0.305: OLED1.19 OLED1.20 26.67,11.35 28.45,13.13 v34.16,13.13 40.84,13.13 41.1,12.88 41.91,12.88 42.29,13.26 v42.29,13.61 | U3.26 49.05,7.06 49.05,8.31 49.66,8.92 53.8,8.92 v53.95,8.76
  Bottom 0.305: v34.16,13.13 35.15,13.13 R4.1 | J2.6 53.95,2.68 v53.95,8.76 53.95,12.27 53.42,12.8 43.1,12.8 v42.29,13.61
IO5/SCL  (via drill 0.3)  (1 unrouted)
  Top 0.305: U1.IO5 52.81,7.12 v52.81,8.2 | OLED1.18 25.27,11 28.14,13.87 v33.5,13.87 41.2,13.87 v41.43,13.64
  Bottom 0.305: J2.7 52.81,4.08 v52.81,8.2 52.81,11.74 52.3,12.24 42.27,12.24 41.43,13.08 v41.43,13.64 | R2.1 34.85,14.68 34.04,13.87 v33.5,13.87
IO12/MISO  (via drill 0.3)  (1 unrouted)
  Top 0.305: U1.IO12 47.81,24.15 49.05,22.91 v49.05,18.19 | U3.14 47.79,27.85 48.67,28.73 51.4,28.73 J1.6
  Bottom 0.305: R18.1 49.91,18.19 v49.05,18.19
IO13/MOSI  (via drill 0.3)
  Top 0.305: 46.28,20.47 47.19,20.47 47.78,19.89 v47.78,16.74 | 46.28,20.47 45.62,20.47 44.98,21.11 44.98,24.76 U1.IO13 45.27,28.02 46.51,29.26 49.39,29.26 J1.7 | 46.28,20.47 U3.16
  Bottom 0.305: R17.1 v47.78,16.74
IO14/SCLK  (via drill 0.3)  (1 unrouted)
  Top 0.305: U3.13 49.05,25.06 49.05,27.61 49.61,28.17 52.32,28.17 v53.26,29.11 | U1.IO14 49.08,23.92 49.71,23.29 49.71,20.96 v49.81,20.85
  Bottom 0.305: J1.8 49.68,29.11 v53.26,29.11 | R16.1 51.08,20.85 v49.81,20.85
IO15/NSS  (via drill 0.3)
  Top 0.305: U1.IO15 45.27,8.56 44.93,8.89 44.93,11.18 45.36,11.61 U3.23 47.16,11.6 48.28,12.73 48.28,14.53 v48.97,15.22 | v44.45,15.22 44.45,16.97 42.16,19.25 42.16,22.25 40.56,23.85 40.56,26.54 40.97,26.95 43.16,26.95 45.64,29.44 J1.9
  Bottom 0.305: R6.1 49,15.24 v48.97,15.22 v44.45,15.22
IO16  (via drill 0.3)  (1 unrouted)
  Top 0.305: U1.NC1 50.52,7.22 v50.52,8.2
  Bottom 0.305: J2.8 48.19,5.87 v50.52,8.2
IO17  (via drill 0.3)  (1 unrouted)
  Top 0.305: U1.NC2 51.41,7.25 v51.41,8.2
  Bottom 0.305: v51.41,8.2 51.41,8.69 51.16,8.94 50.09,8.94 45.65,4.5 J2.9
IO18  (via drill 0.3)
  Top 0.305: U1.IO18 | U1.IO18 U3.30 | U1.IO18 54.15,6.02 53.92,5.79 35.74,5.79 33.76,3.81 25.53,3.81 v25.27,3.56
  Bottom 0.305: U2.20 v25.28,3.56 v25.27,3.56
IO19  (via drill 0.3)  (1 unrouted)
  Top 0.305: U1.IO19 U3.31 55.4,7.03 55.4,5.97 54.69,5.26 35.97,5.26 33.98,3.28 26.82,3.28 v26.67,3.12
  Bottom 0.305: U2.19 26.68,3.13 v26.67,3.12
IO21/CS  (via drill 0.3)  (1 unrouted)
  Top 0.305: 57.94,7.03 U3.33 U1.IO21 57.96,5.99 56.69,4.72 36.25,4.72 34.11,2.59 v29.49,2.59
  Bottom 0.305: U2.17 29.48,2.6 v29.49,2.59
IO22  (via drill 0.3)  (1 unrouted)
  Top 0.305: J2.10 44.69,3.58 62.43,3.58 v62.64,3.79 | v61.09,5.33 61.78,6.02 U1.IO22
  Bottom 0.305: v62.64,3.79 v61.09,5.33
IO23  (via drill 0.3)  (1 unrouted)
  Top 0.305: U1.IO23 U3.37 63.02,7.03 63.02,5.74 61.47,4.19 36.6,4.19 34.29,1.88 28.7,1.88 v28.07,2.52
  Bottom 0.305: U2.18 28.08,2.53 v28.07,2.52
IO25  (via drill 0.3)  (2 unrouted)
  Top 0.305: U3.10 52.87,26.38 53.85,27.36 v53.85,28.4
  Bottom 0.305: J1.10 45.31,28.4 53.67,28.4
IO26  (via drill 0.3)  (1 unrouted)
  Top 0.305: v53.06,27.66 51.6,26.2 U3.11
  Bottom 0.305: J1.11 43.51,27.66 v53.06,27.66
IO27  (via drill 0.3)  (1 unrouted)
  Top 0.305: 50.32,25.03 U3.12 50.33,22.06 v50.47,21.92 | v22.66,21.79 22.81,21.95 38.43,21.95 39.24,21.13 40.49,21.13 v41.27,21.92
  Bottom 0.305: R19.2 v22.66,21.79 | v41.27,21.92 v50.47,21.92
IO32  (via drill 0.3)  (1 unrouted)
  Top 0.305: U1.IO32 U3.8 55.41,22.46 v55.42,22.45 | v20.88,21.84 20.88,22.35 21.54,23.01 39.32,23.01 v39.65,22.68
  Bottom 0.305: v55.42,22.45 54.71,23.17 40.51,23.17 40.03,22.68 v39.65,22.68 | R8.2 20.88,21.16 v20.88,21.84
IO33  (via drill 0.3)  (1 unrouted)
  Top 0.305: U3.9 54.13,25.03 54.13,22.48 v54.1,22.45 | v40.26,22 40.23,21.97 39.27,21.97 38.76,22.48 22.17,22.48 21.72,22.02 21.72,21.39 21.41,21.08 20.45,21.08 19.84,21.69 v19.84,21.84
  Bottom 0.305: v40.26,22 40.87,22.61 53.95,22.61 v54.1,22.45 | R13.2 19.84,21.08 v19.84,21.84
IO34  (via drill 0.3)  (1 unrouted)
  Top 0.305: v23.47,2.18 24.33,1.32 34.85,1.32 v36.4,2.87 | U3.6 57.95,23.36 v57.61,23.01 | v51.36,11.53 v57.15,11.53
  Bottom 0.305: U2.22 R32.1 | R32.1 | v36.4,2.87 37.72,4.19 40.66,4.19 48.01,11.53 v51.36,11.53 | R32.1 v23.47,2.19 v23.47,2.18 | v57.61,23.01 57.61,11.99 v57.15,11.53
IO35  (via drill 0.3)  (1 unrouted)
  Top 0.305: U3.7 56.68,27.04 v56.67,27.05
  Bottom 0.305: J1.12 41.68,26.95 56.57,26.95 v56.67,27.05
IO36/SVP  (via drill 0.3)  (1 unrouted)
  Top 0.305: U1.SENSOR_VP 60.5,23.24 v58.95,21.69 | v51.36,10.16 v58.42,10.16
  Bottom 0.305: J2.11 48.73,10.16 v51.36,10.16 | v58.95,21.69 58.95,11.18 58.95,11.07 58.95,10.92 58.42,10.39 v58.42,10.16
IO39/SVN  (via drill 0.3)  (1 unrouted)
  Top 0.305: U1.SENSOR_VN 59.24,23.3 v58.45,22.5 | v50.55,10.85 v57.81,10.85
  Bottom 0.305: J2.12 39.51,3.48 40.95,3.48 48.31,10.85 v50.55,10.85 | v58.45,22.5 58.27,22.33 58.27,11.3 v57.81,10.85
LEDRX
  Bottom 0.305: U2.13 33.54,10.4 34.01,9.93 R20.1
LEDRXOK
  Bottom 0.305: U2.15 33.57,7.6 34.34,6.83 R22.1
LEDSFD
  Bottom 0.305: U2.14 33.37,9 34.01,8.36 R21.1
LEDTX
  Bottom 0.305: U2.12 34.91,11.8 R15.1
N$1
  Bottom 0.305: R15.2 38.2,11.51 D1.A
N$2
  Bottom 0.305: IC1.16 14.53,21.21 C21.1
N$3  (via drill 0.3)
  Top 0.305: OLED1.14 22.47,10.18 27.76,15.47 v40.84,15.47
  Bottom 0.305: 40.44,16.21 40.82,15.82 40.82,15.75 | v40.84,15.47 40.84,14.68 D7.+ 40.82,16.14 40.84,16.15 | R1.1 40.84,16.15 | 40.84,16.15 41.22,16.15 | 41.22,16.15 41.83,16.15 C17.2 | 40.82,15.6 40.82,15.75 | 40.82,15.75 41.22,16.15
N$4  (via drill 0.3)
  Top 0.305: OLED1.15 23.17,9.94 27.96,14.73 v33.48,14.73
  Bottom 0.305: R25.1 R5.1 35.03,16.28 v33.48,14.73
N$5
  Bottom 0.305: R3.2 35.34,30.94 PWR.C
N$6  (via drill 0.3)
  Top 0.305: OLED1.27 31.57,4.68 v31.73,4.52
  Bottom 0.305: v31.73,4.52 31.73,3.71 C28.2
N$7  (via drill 0.3)
  Top 0.305: OLED1.3 14.77,1.77 v14.96,1.58
  Bottom 0.305: v14.96,1.58 C26.2
N$8  (via drill 0.3)
  Top 0.305: OLED1.28 32.27,4.97 v32.66,4.57
  Bottom 0.305: C29.2 34.16,3.07 v32.66,4.57
N$9  (via drill 0.3)
  Top 0.305: OLED1.26 30.87,4.53 v30.84,4.5
  Bottom 0.305: 31.09,2.85 R26.1 30.84,3.05 v30.84,4.5
N$10
  Bottom 0.305: U2.1 19.68,19.36 R13.1
N$11
  Bottom 0.305: U2.2 21.08,19.27 R8.1
N$12
  Bottom 0.305: U2.3 22.48,19.18 R19.1
N$13
  Bottom 0.305: Q4.1 28.18,21.2 27.3,20.32 26.19,20.32 R12.1
N$14
  Bottom 0.305: Q3.1 24.52,21.99 R11.1
N$15  (via drill 0.3)
  Top 0.254: FLASH.2 22.66,29.83 v22.66,28.55
  Bottom 0.254: R10.1 23.29,28.55
  Bottom 0.305: 23.29,28.55 v22.66,28.55
N$16
  Bottom 0.305: R20.2 D2.A
N$17
  Bottom 0.305: R21.2 38.23,8.36 D4.A
N$18
  Bottom 0.305: R22.2 38.23,6.83 D5.A
N$19  (via drill 0.3)
  Top 0.305: OLED1.2 v14.07,4.01
  Bottom 0.305: v14.07,4.01 C26.1
N$21  (via drill 0.3)
  Top 0.305: OLED1.4 15.47,3.1 v16.99,1.58
  Bottom 0.305: v16.99,1.58 C27.1
N$22  (via drill 0.3)
  Top 0.305: OLED1.5 16.17,4.3 v16.46,4.01
  Bottom 0.305: v16.46,4.01 16.46,3.38 C27.2
N$23
  Bottom 0.305: U6.2 18.47,22.94 R27.1
N$25  (via drill 0.3)
  Top 0.305: USB-TTL.A5 4.85,24.48 v4.12,23.75
  Bottom 0.305: R31.2 v4.12,23.75
N$26  (via drill 0.3)
  Top 0.305: USB-TTL.B5 4.58,21.48 v4.06,22
  Bottom 0.305: v4.06,22 R30.2
N$29  (via drill 0.3)
  Top 0.305: R28.2 14.58,31.27 v14.12,31.73
  Bottom 0.305: U6.7 18.47,31.34 17.93,31.88 14.28,31.88 v14.12,31.73
N$30  (via drill 0.3)
  Top 0.305: R29.2 14.81,29.72 v13.41,31.12
  Bottom 0.305: U6.6 17.2,31.09 16.97,31.32 14.94,31.32 14.55,30.94 13.59,30.94 v13.41,31.12
N$31
  Top 0.305: R28.1 18.36,31.27 D8.C
N$32
  Top 0.305: R29.1 D9.C
NC  (1 unrouted)
RESET  (via drill 0.3)  (1 unrouted)
  Top 0.254: RST.2 28.35,28.92 v28.35,25.53
  Top 0.305: U1.EN 61.78,29.71 J1.3 59.46,32.03 31.46,32.03 RST.2
  Bottom 0.254: v28.35,25.53 v28.34,25.52 Q4.3
  Bottom 0.305: C5.1 30.06,23.33 R9.1 29.4,25.52 Q4.3
RTS  (via drill 0.3)
  Top 0.254: v27.05,21.26 23.34,21.26 22.12,20.04 v15.9,20.04
  Bottom 0.254: IC1.19 15.32,19.46 v15.9,20.04 | 26.28,21.98 27,21.26 v27.05,21.26
  Bottom 0.305: Q4.2 26.28,21.98 R11.2
RXD  (via drill 0.3)  (1 unrouted)
  Top 0.305: U3.34 59.26,7.08 v59.26,8.2 | v39.83,23.55 21.21,23.55 20.3,22.63 19.48,22.63 v17.73,20.88
  Bottom 0.254: IC1.21 11.61,18.57 11.96,18.21 16.51,18.21 17.73,19.43 v17.73,20.88
  Bottom 0.305: J2.3 59.26,3.63 v59.26,8.2 59.26,10.26 59.64,10.64 59.64,22.56 58.5,23.7 39.98,23.7 v39.83,23.55
SD0
  Top 0.305: U1.SD0 42.73,7.8 43.64,8.71 43.64,12.07 45.54,13.97 46.13,13.97 U3.21
SD1
  Top 0.305: U1.SD1 44.3,7.34 44.3,11.41 45.76,12.87 U3.22
SD2
  Top 0.305: U1.SD2 44,24.63 44.27,24.36 44.27,20.7 45.62,19.36 46.17,19.36 U3.17
SD3
  Top 0.305: U1.SD3 42.73,23.87 43.54,23.06 43.54,20.17 45.64,18.06 46.19,18.06 U3.18
TXD  (via drill 0.3)  (1 unrouted)
  Top 0.305: 60.5,7.06 U3.35 | v58.22,8.61 58.55,8.94 59.89,8.94 v60.33,8.51 60.51,8.33 U1.TXD0 | v39.24,24.26 39.14,24.16 20.85,24.16 20.02,23.32 19.94,23.32 19.25,23.32 19.07,23.32 16.84,21.08 v16.84,20.9
  Bottom 0.254: IC1.20 12.11,18.88 12.29,18.69 15.93,18.69 16.84,19.61 v16.84,20.9
  Bottom 0.305: J2.4 58.22,2.13 v58.22,8.61 | v39.24,24.26 39.29,24.31 58.83,24.31 60.17,22.96 60.17,10.34 59.89,10.06 59.89,8.94 v60.33,8.51
VBAT  (via drill 0.3)
  Top 1.016: v26.8,27.43 14.49,27.43 J6.1
  Bottom 0.254: v26.8,27.43 26.88,27.43 26.98,27.53
  Bottom 0.61: 15.39,30.23 U6.5
  Bottom 0.813: Q1.3 26.98,27.53 27.51,27.53 D11.+
  Bottom 1.016: J6.1 12.02,29.9 C20.1 15.06,29.9 15.39,30.23
VBUS  (via drill 0.3)  (1 unrouted)
  Top 0.254: v7.16,25.68 | USB-TTL.VBUS2
  Top 0.61: USB-TTL.VBUS1 v7.16,25.68 | v7.16,20.78 USB-TTL.VBUS2
  Top 0.813: D8.A D9.A 20.68,29.72 v21.36,29.03 | v21.36,26.06 19.68,24.38 v15.06,24.38 8.46,24.38 v7.16,25.68
  Bottom 0.254: IC1.8 10.61,24.86 C2.1 C1.1 C18.1 14.76,25.2 15.29,24.66 | 15.29,24.66 U6.4 | v15.06,24.38 15.29,24.61 15.29,24.66 | 10.64,24.13 11.2,24.69
  Bottom 0.305: U6.8 20.17,29.79 C19.1 | C19.1 R24.1 24.84,29.79 Q1.1 25.01,31.02 D10.+ | C19.1 21.57,29.24 v21.36,29.03
  Bottom 0.813: v7.16,25.68 v7.16,20.78 | v21.36,26.06 21.36,29.59 C19.1
  pour Bottom: 16.21,23.37 15.34,23.37 14.3,24.41 10.62,24.41 10.62,25.63 15.19,25.63 16.18,24.64 16.21,24.64
  pour Bottom: 19.43,30.89 19.43,29.46 20.4,29.46 21.16,28.7 21.64,28.7 22.2,29.26 25.43,29.26 25.76,29.26 25.76,31.7 24.08,31.7 24.08,30.58 23.67,30.18 20.93,30.18 20.55,30.56 20.55,30.78 20.55,30.89
VDD  (via drill 0.3)
  Top 0.813: v39.37,26.04 34.04,26.04 v32.31,27.76
  Bottom 0.305: Q1.2 26.91,31.07 D10.- 27.2,31.22 D11.- 29.14,30.89 C7.1 30.56,30.87 C13.2 30.56,28.3 31.09,27.76 32.65,27.76 U4.3
  Bottom 0.813: J2.1 61.65,6.32 61.65,24 59.61,26.04 v39.37,26.04
  pour Bottom: 26.44,29.01 26.44,31.78 30.68,31.78 31.09,31.37 31.09,28.6 31.5,28.19 33.45,28.19 34.54,27.1 34.54,26.21 33.12,26.21 33.12,26.72 32.59,27.25 30.71,27.25 29.87,28.09 29.87,29.97 29.31,30.53 28.12,30.53 27.76,30.18 27.76,29.03 27.76,29.01

### Text on the board
tPlace: - | +
bPlace: - | + | IO35 | IO26 | IO25 | IO15 | IO14 | IO13 | IO12 | IO2 | GND | RST | GND | 3V3 | ESP32 UWB Pro | with Display v1.2 | www.makerfabs.com | IO39 | IO36 | IO22 | IO17 | IO16 | IO5 | IO4 | IO0 | TXD | RXD | GND | VDD
tNames: U1